# Altium schematic sheet V1.0.SchDoc
size 114 x 50 mm
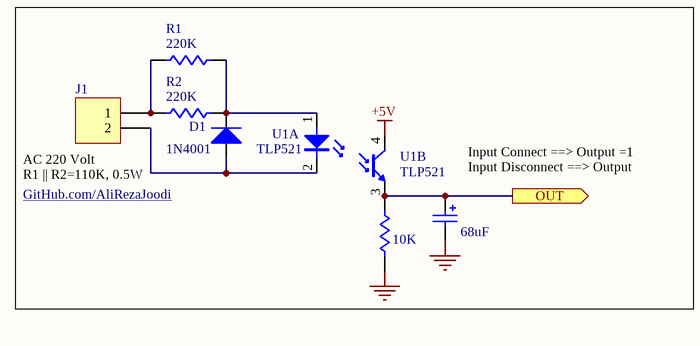
[diagram p0: V1.0.SchDoc]

## Parts
C1  value 68uF  [Cap_D]  (hidden comment: CAP)
D1  1N4001  [MELF-D3516-1406]
J1  J9  [Fonics_2PIN_1]  (value not drawn)
R1  value 220K  [0805]  (hidden comment: RES)
R2  value 220K  [0805]  (hidden comment: RES)
R3  value 10K  [0805]  (hidden comment: RES)
U1  TLP521  [SMD_4PIN]  (parts A,B of 2)

## Ports
OUT (out)

## Nets
+5V: U1.4(C)
GND: C1.2 R3.2
OUT: C1.1 R3.1 U1.3(E) ; port OUT
NetD1_1: D1.1(A) J1.2 U1.2(K)
NetD1_2: D1.2(K) R1.2 R2.2 U1.1(A)
NetJ1_1: J1.1 R1.1 R2.1

## Notes on the sheet
- (near J1) AC 220 Volt
  R1 || R2=110K, 0.5W
- (near C1) Input Connect ==> Output =1
  Input Disconnect ==> Output =0
- GitHub.com/AliRezaJoodi

## Library data of the parts
C1 = Cap Pol1: Polarized Capacitor (Radial); Manufacturer: Generic Components; Class I: Passive; Published: 8-Jun-2000; Revision: July-2002: Re-released for DXP Platform.; Publisher: Altium Limited; Class II: Capacitor
D1 = Diode: Default Diode; Manufacturer: Generic Components; Class I: Discrete; Class II: Diode - Switching; Published: 8-Jun-2000; Revision: July-2002: Re-released for DXP Platform.; Publisher: Altium Limited; Value: 1N4001
J1 = Header 2: Header, 2-Pin; LatestRevisionDate: 17-Jul-2002; LatestRevisionNote: Re-released for DXP Platform.; Publisher: Altium Limited
R1-R3 = Res1: Resistor; Manufacturer: Generic Components; Class I: Passive; Published: 8-Jun-2000; Revision: July-2002: Re-released for DXP Platform.; Publisher: Altium Limited; Class II: Resistor
U1 = Optoisolator: Publisher: Altium Limited